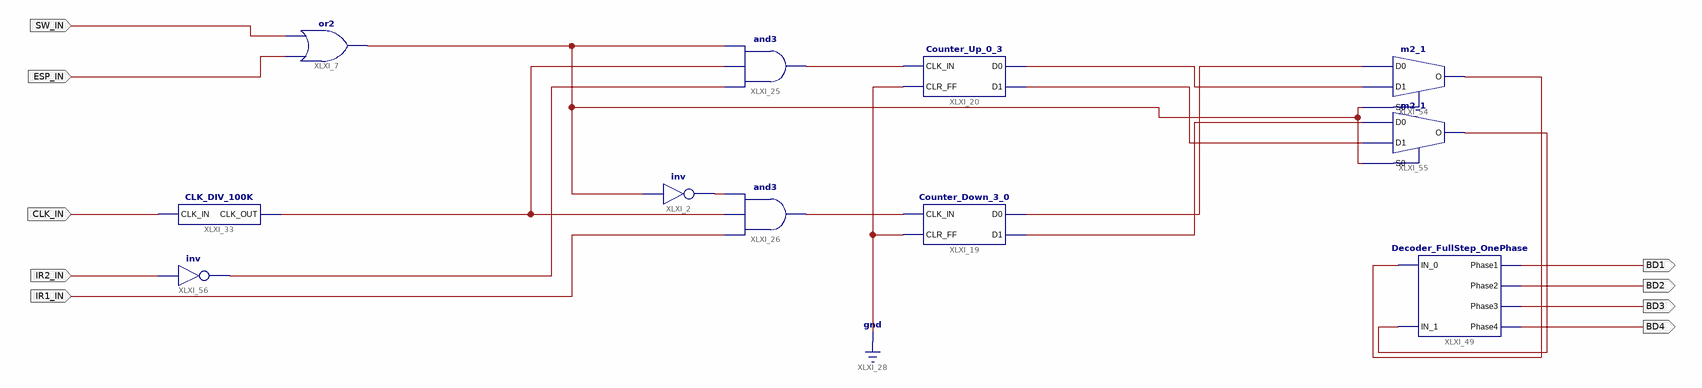
[diagram p0: schematic sheet 1]
// Xilinx ISE schematic Garage_Door_V6.sch (spartan6) as structural Verilog: 11 symbols, 9 ports
module Garage_Door_V6 (
  input  CLK_IN,
  input  IR1_IN,
  input  ESP_IN,
  input  SW_IN,
  input  IR2_IN,
  output BD1,
  output BD2,
  output BD3,
  output BD4
);

  wire XLXN_5, XLXN_8, XLXN_9, XLXN_10, XLXN_99, XLXN_100, XLXN_101, XLXN_102, XLXN_103, XLXN_104, XLXN_105,
       XLXN_107;

  not XLXI_2 (XLXN_8, XLXN_99);
  and XLXI_25 (XLXN_10, XLXN_107, XLXN_5, XLXN_99);
  and XLXI_26 (XLXN_9, IR1_IN, XLXN_5, XLXN_8);
  Counter_Up_0_3 XLXI_20 (.CLK_IN(XLXN_10), .CLR_FF(1'b0), .D0(XLXN_100), .D1(XLXN_101));
  Counter_Down_3_0 XLXI_19 (.CLK_IN(XLXN_9), .CLR_FF(1'b0), .D0(XLXN_102), .D1(XLXN_103));
  or XLXI_7 (XLXN_99, ESP_IN, SW_IN);
  CLK_DIV_100K XLXI_33 (.CLK_IN(CLK_IN), .CLK_OUT(XLXN_5));
  Decoder_FullStep_OnePhase XLXI_49 (
    .IN_0(XLXN_104), .IN_1(XLXN_105), .Phase1(BD1), .Phase2(BD2), .Phase3(BD3), .Phase4(BD4));
  m2_1 XLXI_54 (.D0(XLXN_102), .D1(XLXN_100), .S0(XLXN_99), .O(XLXN_104));
  m2_1 XLXI_55 (.D0(XLXN_103), .D1(XLXN_101), .S0(XLXN_99), .O(XLXN_105));
  not XLXI_56 (XLXN_107, IR2_IN);
endmodule
